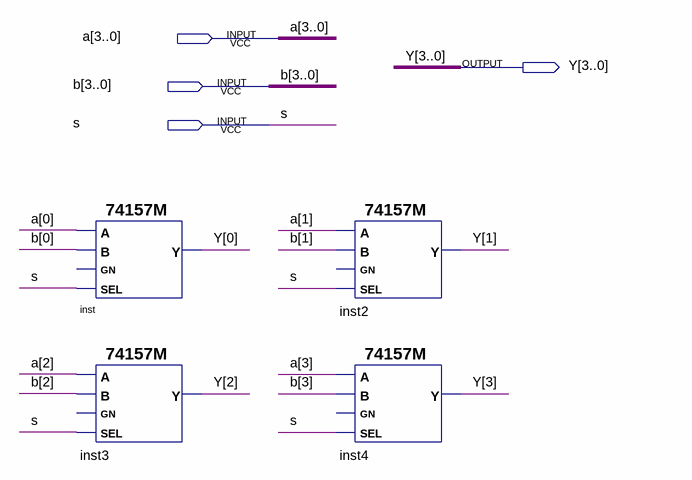
[diagram p0: schematic sheet]
// Quartus schematic mux2to1bit4.bdf as structural Verilog: 4 symbols, 4 pins
module mux2to1bit4 (
  input  [3:0] a,
  input  [3:0] b,
  input  s,
  output [3:0] Y
);

  \74157M  inst (.SEL(s), .B(b[0]), .A(a[0]), .Y(Y[0]));  // open: GN
  \74157M  inst3 (.SEL(s), .B(b[2]), .A(a[2]), .Y(Y[2]));  // open: GN
  \74157M  inst2 (.SEL(s), .B(b[1]), .A(a[1]), .Y(Y[1]));  // open: GN
  \74157M  inst4 (.SEL(s), .B(b[3]), .A(a[3]), .Y(Y[3]));  // open: GN
endmodule
